# EAGLE schematic Wooby (EAGLE 9.6.2)
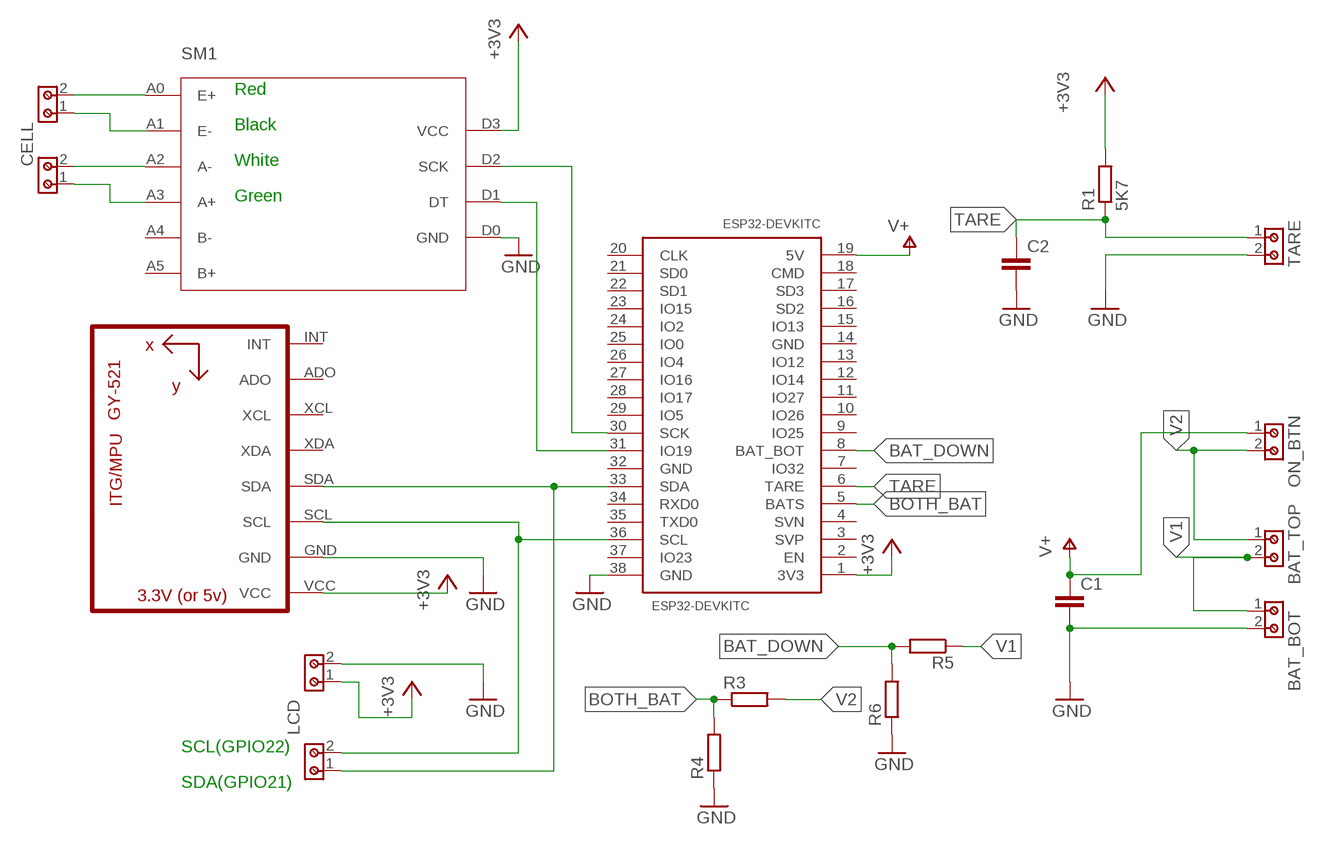
[diagram p0: schematic, sheet 1]

## Parts
BAT_BOT  691210910002  [691210910002]
BAT_TOP  691210910002  [691210910002]
C1  C5/3  [C5B3]
C2  C5/3  [C5B3]
CELL  691210910002  [691210910002]
ESP32-DEVKITC  ESP32DEVKITC  [ESP32-DEVKITC]
J2  691210910002  [691210910002]
J5  691210910002  [691210910002]
LCD  691210910002  [691210910002]
ON_BTN  691210910002  [691210910002]
R1  5K7  R-EU_0207/10  [0207/10]
R3  R-EU_0207/10  [0207/10]
R4  R-EU_0207/10  [0207/10]
R5  R-EU_0207/10  [0207/10]
R6  R-EU_0207/10  [0207/10]
SM1  HX711  [HX711]
TARE  691210910002  [691210910002]
U1  GY-521MPU6050  [GY-521]

## Nets
+3V3: ESP32-DEVKITC.1(3V3) LCD.1 R1.2 SM1.D3(VCC) U1.VCC
BAT_DOWN: ESP32-DEVKITC.8(BAT_BOT) R5.2 R6.2
BOTH_BAT: ESP32-DEVKITC.5(BATS) R3.1 R4.2
GND: BAT_BOT.2 C1.2 C2.2 ESP32-DEVKITC.38(GND) LCD.2 R4.1 R6.1 SM1.D0(GND) TARE.2 U1.GND
N$1: CELL.1 SM1.A1(E-)
N$2: CELL.2 SM1.A0(E+)
N$3: J5.1 SM1.A3(A+)
N$4: J5.2 SM1.A2(A-)
N$6: ESP32-DEVKITC.36(SCL) J2.2 U1.SCL
N$7: ESP32-DEVKITC.33(SDA) J2.1 U1.SDA
N$9: ESP32-DEVKITC.31(IO19) SM1.D1(DT)
N$10: ESP32-DEVKITC.30(SCK) SM1.D2(SCK)
TARE: C2.1 ESP32-DEVKITC.6(TARE) R1.1 TARE.1
V1: BAT_BOT.1 BAT_TOP.2 R5.1
V2: BAT_TOP.1 ON_BTN.2 R3.2
V+: C1.1 ESP32-DEVKITC.19(5V) ON_BTN.1
Unconnected: ESP32-DEVKITC.2(EN) ESP32-DEVKITC.3(SVP) ESP32-DEVKITC.4(SVN) ESP32-DEVKITC.7(IO32) ESP32-DEVKITC.9(IO25) ESP32-DEVKITC.10(IO26) ESP32-DEVKITC.11(IO27) ESP32-DEVKITC.12(IO14) ESP32-DEVKITC.13(IO12) ESP32-DEVKITC.14(GND) ESP32-DEVKITC.15(IO13) ESP32-DEVKITC.16(SD2) ESP32-DEVKITC.17(SD3) ESP32-DEVKITC.18(CMD) ESP32-DEVKITC.20(CLK) ESP32-DEVKITC.21(SD0) ESP32-DEVKITC.22(SD1) ESP32-DEVKITC.23(IO15) ESP32-DEVKITC.24(IO2) ESP32-DEVKITC.25(IO0) ESP32-DEVKITC.26(IO4) ESP32-DEVKITC.27(IO16) ESP32-DEVKITC.28(IO17) ESP32-DEVKITC.29(IO5) ESP32-DEVKITC.32(GND) ESP32-DEVKITC.34(RXD0) ESP32-DEVKITC.35(TXD0) ESP32-DEVKITC.37(IO23) SM1.A4(B-) SM1.A5(B+) U1.ADO U1.INT U1.XCL U1.XDA

## Notes on the sheet
- Red
- Black
- White
- Green
- SCL(GPIO22)
- SDA(GPIO21)

## Library data of the parts
BAT_BOT BAT_TOP CELL J2 J5 LCD ON_BTN TARE = 691210910002:691210910002: WR-TBL Serie 2109 - 2.54 mm Horiz. Entry KIND PROPERTIES Pitch 2.54 mm MATERIAL PROPERTIES Insulator Material PA66 Insulator Flammability Rating UL94 V-0 Insulator Color Green Contact Material Brass Contact Plating Copper over Zinc Terminal Screw Material Steel Terminal Screw Plating Zinc Wire Guard Material Brass GENERAL INFORMATION Operating Temperature -40 up to +105 °C Compliance Lead free / RoHS ELECTRICAL PROPERTIES IR cULus 6 A Working Voltage [cULus] 150 V (AC) Withstanding Voltage [cULus] 1300 V (AC) Contact Resistance [cULus] 20 mΩ MECHANICAL PROPERTIES Wire Strip Length 4 up to 5 (mm) Screw M1.6 Solid Wire Section (AWG) 30 to 18 (AWG) Solid Wire Section (Metric) 0.0509 to 0.823 (mm²) Stranded Wire Section (AWG) 30 to 18 (AWG) Stranded Wire Section (Metric) 0.0509 to 0.823 (mm²) CERTIFICATION cULus Approval E315414 PACKAGING PROPERTIES Packaging Box <https://katalog.we-online.com/media/images/v2/o33231v209%20Family_WR-TBL_69121091000x.jpg> Details see: https://katalog.we-online.com/en/em/TBL_2_54_2109_HORIZONTAL_ENTRY_69121091000X Updated by Ella Wu 2019-11-12 2019(C) Wurth Elektronik Check prices <https://pricing.snapeda.com/parts/691210910002/W%C3%BCrth%20Elektronik/view-part?ref=eda>; AVAILABILITY: Warning; DESCRIPTION: 2 Position Wire to Board Terminal Block Horizontal with Board 0.100 (2.54mm) Through Hole; MF: Würth Elektronik; MP: 691210910002; PACKAGE: None; PRICE: None; PURCHASE-URL: https://pricing.snapeda.com/search/part/691210910002/?ref=eda
C1 C2 = capacitor-wima:C: CAPACITOR naming: grid - package width
ESP32-DEVKITC = ESP32:ESP32DEVKITC
R1 R3-R6 = rcl:R-EU_: RESISTOR, European symbol; SPICEPREFIX: R
SM1 = hx711:HX711: HX711 module is a Load Cell Amplifier breakout board for the HX711 IC that allows you to easily read load cells to measure weight. This module uses 24 high precision A/D converter chip HX711. It is a specially designed for the high precision electronic scale design, with two analog input channel, the internal integration of 128 times the programmable gain amplifier. The input circuit can be configured to provide a bridge type pressure bridge (such as pressure, weighing sensor mode), is of high precision, low cost is an ideal sampling front-end module.
U1 = MPU-6050:GY-521